# Altium project FMC_HPC_Breakout.PrjPcb
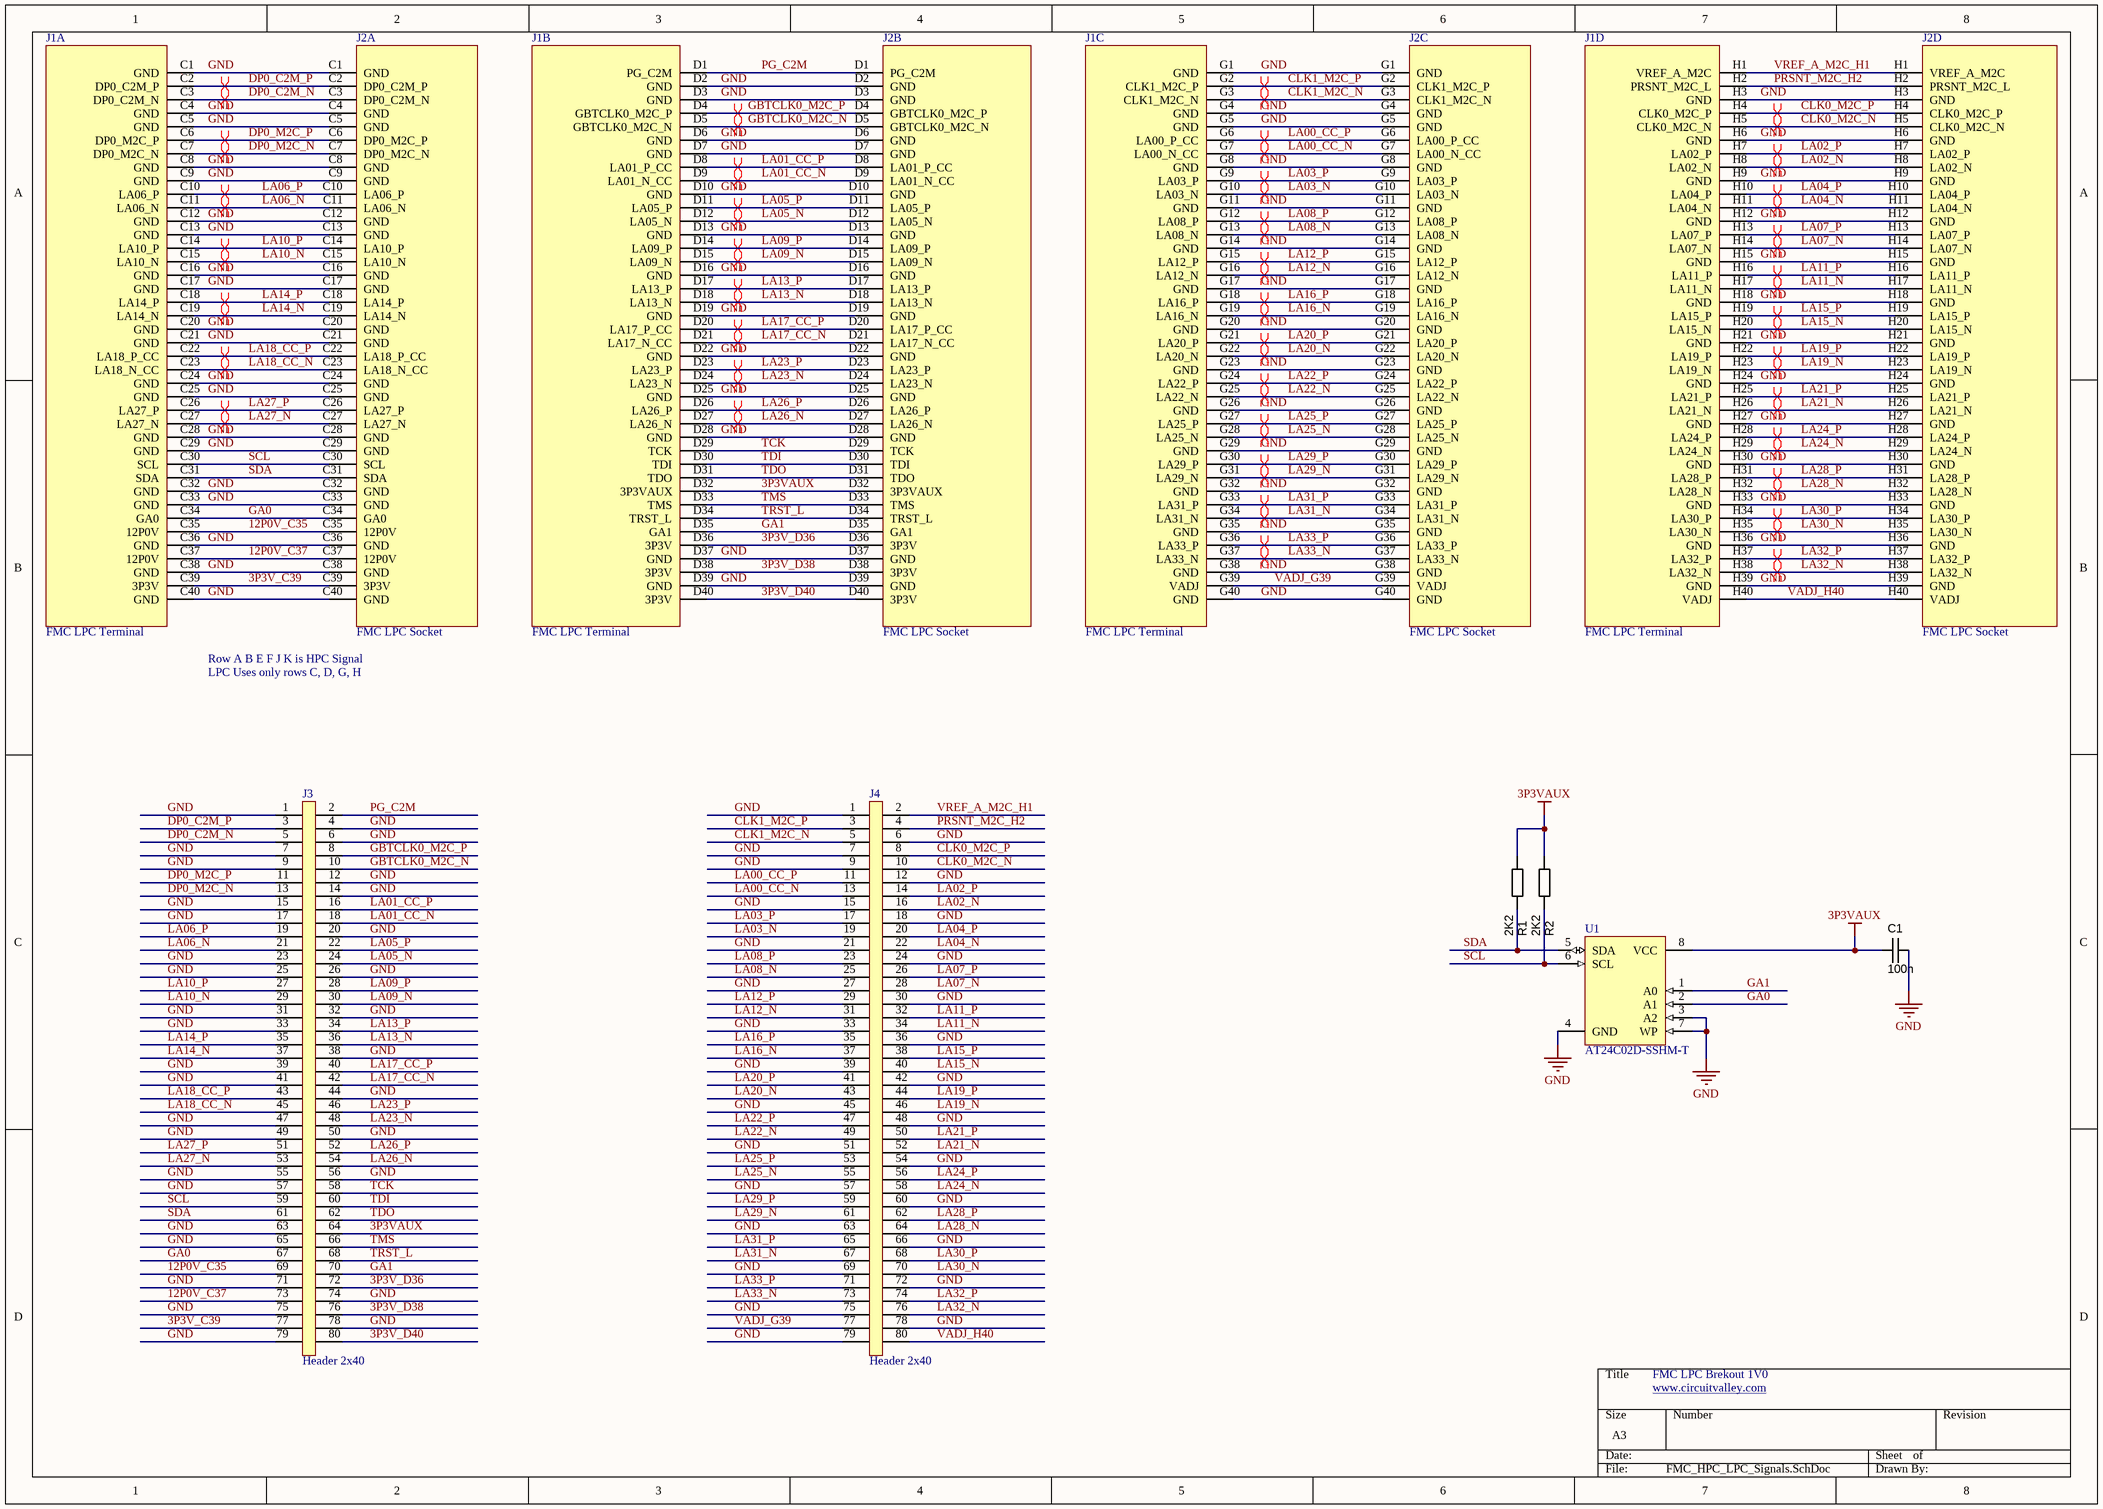
[diagram p0: FMC_HPC_LPC_Signals.SchDoc]
1 sheet, 8 parts. Net scope: global (net labels, ports and power ports of the same name join across sheets).
Board file: FMC_HPC.PcbDoc

## Sheet FMC_HPC_LPC_Signals.SchDoc
size A3; SheetNumber: 1; SheetTotal: 1

### Parts
C1  100n  [CAPC1005N]
J1  FMC LPC Terminal  [SAMTEC_ASP-134604-01]  (parts A,B,C,D of 4)
J2  FMC LPC Socket  [SAMTEC_ASP-134603-01]  (parts A,B,C,D of 4)
J3  Header 2x40  [FTSH-140-01-L-DV]
J4  Header 2x40  [FTSH-140-01-L-DV]
R1  value 2K2  [RESC1005N]  (hidden comment: Thick Film)
R2  value 2K2  [RESC1005N]  (hidden comment: Thick Film)
U1  AT24C02D-SSHM-T  [SOIC8]

### Nets
3P3VAUX: C1.2 J1.D32(3P3VAUX) J2.D32(3P3VAUX) J3.64 R1.1 R2.1 U1.8(VCC)
GND: C1.1 J1.C1(GND) J1.C4(GND) J1.C5(GND) J1.C8(GND) J1.C9(GND) J1.C12(GND) J1.C13(GND) J1.C16(GND) J1.C17(GND) J1.C20(GND) J1.C21(GND) J1.C24(GND) J1.C25(GND) J1.C28(GND) J1.C29(GND) J1.C32(GND) J1.C33(GND) J1.C36(GND) J1.C38(GND) J1.C40(GND) J1.D2(GND) J1.D3(GND) J1.D6(GND) J1.D7(GND) J1.D10(GND) J1.D13(GND) J1.D16(GND) J1.D19(GND) J1.D22(GND) J1.D25(GND) J1.D28(GND) J1.D37(GND) J1.D39(GND) J1.G1(GND) J1.G4(GND) J1.G5(GND) J1.G8(GND) J1.G11(GND) J1.G14(GND) J1.G17(GND) J1.G20(GND) J1.G23(GND) J1.G26(GND) J1.G29(GND) J1.G32(GND) J1.G35(GND) J1.G38(GND) J1.G40(GND) J1.H3(GND) J1.H6(GND) J1.H9(GND) J1.H12(GND) J1.H15(GND) J1.H18(GND) J1.H21(GND) J1.H24(GND) J1.H27(GND) J1.H30(GND) J1.H33(GND) J1.H36(GND) J1.H39(GND) J2.C1(GND) J2.C4(GND) J2.C5(GND) J2.C8(GND) J2.C9(GND) J2.C12(GND) J2.C13(GND) J2.C16(GND) J2.C17(GND) J2.C20(GND) J2.C21(GND) J2.C24(GND) J2.C25(GND) J2.C28(GND) J2.C29(GND) J2.C32(GND) J2.C33(GND) J2.C36(GND) J2.C38(GND) J2.C40(GND) J2.D2(GND) J2.D3(GND) J2.D6(GND) J2.D7(GND) J2.D10(GND) J2.D13(GND) J2.D16(GND) J2.D19(GND) J2.D22(GND) J2.D25(GND) J2.D28(GND) J2.D37(GND) J2.D39(GND) J2.G1(GND) J2.G4(GND) J2.G5(GND) J2.G8(GND) J2.G11(GND) J2.G14(GND) J2.G17(GND) J2.G20(GND) J2.G23(GND) J2.G26(GND) J2.G29(GND) J2.G32(GND) J2.G35(GND) J2.G38(GND) J2.G40(GND) J2.H3(GND) J2.H6(GND) J2.H9(GND) J2.H12(GND) J2.H15(GND) J2.H18(GND) J2.H21(GND) J2.H24(GND) J2.H27(GND) J2.H30(GND) J2.H33(GND) J2.H36(GND) J2.H39(GND) J3.1 J3.4 J3.6 J3.7 J3.9 J3.12 J3.14 J3.15 J3.17 J3.20 J3.23 J3.25 J3.26 J3.31 J3.32 J3.33 J3.38 J3.39 J3.41 J3.44 J3.47 J3.49 J3.50 J3.55 J3.56 J3.57 J3.63 J3.65 J3.71 J3.74 J3.75 J3.78 J3.79 J4.1 J4.6 J4.7 J4.9 J4.12 J4.15 J4.18 J4.21 J4.24 J4.27 J4.30 J4.33 J4.36 J4.39 J4.42 J4.45 J4.48 J4.51 J4.54 J4.57 J4.60 J4.63 J4.66 J4.69 J4.72 J4.75 J4.78 J4.79 U1.3(A2) U1.4(GND) U1.7(WP)
3P3V_C39: J1.C39(3P3V) J2.C39(3P3V) J3.77
3P3V_D36: J1.D36(3P3V) J2.D36(3P3V) J3.72
3P3V_D38: J1.D38(3P3V) J2.D38(3P3V) J3.76
3P3V_D40: J1.D40(3P3V) J2.D40(3P3V) J3.80
12P0V_C35: J1.C35(12P0V) J2.C35(12P0V) J3.69
12P0V_C37: J1.C37(12P0V) J2.C37(12P0V) J3.73
CLK0_M2C_N: J1.H5(CLK0_M2C_N) J2.H5(CLK0_M2C_N) J4.10
CLK0_M2C_P: J1.H4(CLK0_M2C_P) J2.H4(CLK0_M2C_P) J4.8
CLK1_M2C_N: J1.G3(CLK1_M2C_N) J2.G3(CLK1_M2C_N) J4.5
CLK1_M2C_P: J1.G2(CLK1_M2C_P) J2.G2(CLK1_M2C_P) J4.3
DP0_C2M_N: J1.C3(DP0_C2M_N) J2.C3(DP0_C2M_N) J3.5
DP0_C2M_P: J1.C2(DP0_C2M_P) J2.C2(DP0_C2M_P) J3.3
DP0_M2C_N: J1.C7(DP0_M2C_N) J2.C7(DP0_M2C_N) J3.13
DP0_M2C_P: J1.C6(DP0_M2C_P) J2.C6(DP0_M2C_P) J3.11
GA0: J1.C34(GA0) J2.C34(GA0) J3.67 U1.2(A1)
GA1: J1.D35(GA1) J2.D35(GA1) J3.70 U1.1(A0)
GBTCLK0_M2C_N: J1.D5(GBTCLK0_M2C_N) J2.D5(GBTCLK0_M2C_N) J3.10
GBTCLK0_M2C_P: J1.D4(GBTCLK0_M2C_P) J2.D4(GBTCLK0_M2C_P) J3.8
LA00_CC_N: J1.G7(LA00_N_CC) J2.G7(LA00_N_CC) J4.13
LA00_CC_P: J1.G6(LA00_P_CC) J2.G6(LA00_P_CC) J4.11
LA01_CC_N: J1.D9(LA01_N_CC) J2.D9(LA01_N_CC) J3.18
LA01_CC_P: J1.D8(LA01_P_CC) J2.D8(LA01_P_CC) J3.16
LA02_N: J1.H8(LA02_N) J2.H8(LA02_N) J4.16
LA02_P: J1.H7(LA02_P) J2.H7(LA02_P) J4.14
LA03_N: J1.G10(LA03_N) J2.G10(LA03_N) J4.19
LA03_P: J1.G9(LA03_P) J2.G9(LA03_P) J4.17
LA04_N: J1.H11(LA04_N) J2.H11(LA04_N) J4.22
LA04_P: J1.H10(LA04_P) J2.H10(LA04_P) J4.20
LA05_N: J1.D12(LA05_N) J2.D12(LA05_N) J3.24
LA05_P: J1.D11(LA05_P) J2.D11(LA05_P) J3.22
LA06_N: J1.C11(LA06_N) J2.C11(LA06_N) J3.21
LA06_P: J1.C10(LA06_P) J2.C10(LA06_P) J3.19
LA07_N: J1.H14(LA07_N) J2.H14(LA07_N) J4.28
LA07_P: J1.H13(LA07_P) J2.H13(LA07_P) J4.26
LA08_N: J1.G13(LA08_N) J2.G13(LA08_N) J4.25
LA08_P: J1.G12(LA08_P) J2.G12(LA08_P) J4.23
LA09_N: J1.D15(LA09_N) J2.D15(LA09_N) J3.30
LA09_P: J1.D14(LA09_P) J2.D14(LA09_P) J3.28
LA10_N: J1.C15(LA10_N) J2.C15(LA10_N) J3.29
LA10_P: J1.C14(LA10_P) J2.C14(LA10_P) J3.27
LA11_N: J1.H17(LA11_N) J2.H17(LA11_N) J4.34
LA11_P: J1.H16(LA11_P) J2.H16(LA11_P) J4.32
LA12_N: J1.G16(LA12_N) J2.G16(LA12_N) J4.31
LA12_P: J1.G15(LA12_P) J2.G15(LA12_P) J4.29
LA13_N: J1.D18(LA13_N) J2.D18(LA13_N) J3.36
LA13_P: J1.D17(LA13_P) J2.D17(LA13_P) J3.34
LA14_N: J1.C19(LA14_N) J2.C19(LA14_N) J3.37
LA14_P: J1.C18(LA14_P) J2.C18(LA14_P) J3.35
LA15_N: J1.H20(LA15_N) J2.H20(LA15_N) J4.40
LA15_P: J1.H19(LA15_P) J2.H19(LA15_P) J4.38
LA16_N: J1.G19(LA16_N) J2.G19(LA16_N) J4.37
LA16_P: J1.G18(LA16_P) J2.G18(LA16_P) J4.35
LA17_CC_N: J1.D21(LA17_N_CC) J2.D21(LA17_N_CC) J3.42
LA17_CC_P: J1.D20(LA17_P_CC) J2.D20(LA17_P_CC) J3.40
LA18_CC_N: J1.C23(LA18_N_CC) J2.C23(LA18_N_CC) J3.45
LA18_CC_P: J1.C22(LA18_P_CC) J2.C22(LA18_P_CC) J3.43
LA19_N: J1.H23(LA19_N) J2.H23(LA19_N) J4.46
LA19_P: J1.H22(LA19_P) J2.H22(LA19_P) J4.44
LA20_N: J1.G22(LA20_N) J2.G22(LA20_N) J4.43
LA20_P: J1.G21(LA20_P) J2.G21(LA20_P) J4.41
LA21_N: J1.H26(LA21_N) J2.H26(LA21_N) J4.52
LA21_P: J1.H25(LA21_P) J2.H25(LA21_P) J4.50
LA22_N: J1.G25(LA22_N) J2.G25(LA22_N) J4.49
LA22_P: J1.G24(LA22_P) J2.G24(LA22_P) J4.47
LA23_N: J1.D24(LA23_N) J2.D24(LA23_N) J3.48
LA23_P: J1.D23(LA23_P) J2.D23(LA23_P) J3.46
LA24_N: J1.H29(LA24_N) J2.H29(LA24_N) J4.58
LA24_P: J1.H28(LA24_P) J2.H28(LA24_P) J4.56
LA25_N: J1.G28(LA25_N) J2.G28(LA25_N) J4.55
LA25_P: J1.G27(LA25_P) J2.G27(LA25_P) J4.53
LA26_N: J1.D27(LA26_N) J2.D27(LA26_N) J3.54
LA26_P: J1.D26(LA26_P) J2.D26(LA26_P) J3.52
LA27_N: J1.C27(LA27_N) J2.C27(LA27_N) J3.53
LA27_P: J1.C26(LA27_P) J2.C26(LA27_P) J3.51
LA28_N: J1.H32(LA28_N) J2.H32(LA28_N) J4.64
LA28_P: J1.H31(LA28_P) J2.H31(LA28_P) J4.62
LA29_N: J1.G31(LA29_N) J2.G31(LA29_N) J4.61
LA29_P: J1.G30(LA29_P) J2.G30(LA29_P) J4.59
LA30_N: J1.H35(LA30_N) J2.H35(LA30_N) J4.70
LA30_P: J1.H34(LA30_P) J2.H34(LA30_P) J4.68
LA31_N: J1.G34(LA31_N) J2.G34(LA31_N) J4.67
LA31_P: J1.G33(LA31_P) J2.G33(LA31_P) J4.65
LA32_N: J1.H38(LA32_N) J2.H38(LA32_N) J4.76
LA32_P: J1.H37(LA32_P) J2.H37(LA32_P) J4.74
LA33_N: J1.G37(LA33_N) J2.G37(LA33_N) J4.73
LA33_P: J1.G36(LA33_P) J2.G36(LA33_P) J4.71
PG_C2M: J1.D1(PG_C2M) J2.D1(PG_C2M) J3.2
PRSNT_M2C_H2: J1.H2(PRSNT_M2C_L) J2.H2(PRSNT_M2C_L) J4.4
SCL: J1.C30(SCL) J2.C30(SCL) J3.59 R2.2 U1.6(SCL)
SDA: J1.C31(SDA) J2.C31(SDA) J3.61 R1.2 U1.5(SDA)
TCK: J1.D29(TCK) J2.D29(TCK) J3.58
TDI: J1.D30(TDI) J2.D30(TDI) J3.60
TDO: J1.D31(TDO) J2.D31(TDO) J3.62
TMS: J1.D33(TMS) J2.D33(TMS) J3.66
TRST_L: J1.D34(TRST_L) J2.D34(TRST_L) J3.68
VADJ_G39: J1.G39(VADJ) J2.G39(VADJ) J4.77
VADJ_H40: J1.H40(VADJ) J2.H40(VADJ) J4.80
VREF_A_M2C_H1: J1.H1(VREF_A_M2C) J2.H1(VREF_A_M2C) J4.2

### Layout directives
differential pair: CLK0_M2C_N, CLK0_M2C_P, CLK1_M2C_N, CLK1_M2C_P, DP0_C2M_N, DP0_C2M_P, DP0_M2C_N, DP0_M2C_P, GBTCLK0_M2C_N, GBTCLK0_M2C_P, LA00_CC_N, LA00_CC_P, LA01_CC_N, LA01_CC_P, LA02_N, LA02_P, LA03_N, LA03_P, LA04_N, LA04_P, LA05_N, LA05_P, LA06_N, LA06_P, LA07_N, LA07_P, LA08_N, LA08_P, LA09_N, LA09_P, LA10_N, LA10_P, LA11_N, LA11_P, LA12_N, LA12_P, LA13_N, LA13_P, LA14_N, LA14_P, LA15_N, LA15_P, LA16_N, LA16_P, LA17_CC_N, LA17_CC_P, LA18_CC_N, LA18_CC_P, LA19_N, LA19_P, LA20_N, LA20_P, LA21_N, LA21_P, LA22_N, LA22_P, LA23_N, LA23_P, LA24_N, LA24_P, LA25_N, LA25_P, LA26_N, LA26_P, LA27_N, LA27_P, LA28_N, LA28_P, LA29_N, LA29_P, LA30_N, LA30_P, LA31_N, LA31_P, LA32_N, LA32_P, LA33_N, LA33_P

### Notes on the sheet
- Row A B E F J K is HPC Signal
- LPC Uses only rows C, D, G, H
- FMC LPC Brekout 1V0
- www.circuitvalley.com <http://www.circuitvalley.com>

### Library data of the parts
C1 = CAPC_10n_0402_16V_10%: Capacitor SMD Cer 10nF 10% 16V X7R 0402; Manufacturer 1: AVX Corporation; Manufacturer Part Number 1: 0402YC103KAT2A; Ratings: 16V; X7R; Tolerance: ±10%; Operating Temperature: -55°C ~ 125°C; Package / Case: 0402 (1005 Metric); Size / Dimension: 0.039" L x 0.020" W (1.00mm x 0.50mm); Manufacturer 2: Yageo; Manufacturer Part Number 2: CC0402KRX7R7BB103; Supplier 1: Digi-Key; Supplier Part Number 1: 478-1114-1-ND; ComponentLink1URL: http://www.avx.com/docs/Catalogs/cx7r.pdf; ComponentLink1Description: http://www.avx.com/docs/Catalogs/cx7r.pdf; Supplier 2: Digi-Key; Supplier Part Number 2: 311-1042-1-ND; ComponentLink2URL: http://www.yageo.com/documents/recent/UPY-GPHC_X7R_6.3V-to-50V_8.pdf; ComponentLink2Description: http://www.yageo.com/documents/recent/UPY-GPHC_X7R_6.3V-to-50V_8.pdf; Value: 100n
J1 = FMC_LPC_TERMINAL: FMC LPC Connector Terminal ASP-134604-01
J2 = FMC_LPC_SOCKET: FMC LPC Connector Socket  ASP-134603-01
J3 J4 = Header_2x40
R1 R2 = RES_3K3_0402_5%: Resistor SMD chip 3.3k Ohm 0.063W 5% 0402; Manufacturer 1: Yageo; Manufacturer Part Number 1: RC0402JR-073K3L; Ratings: 1/16 W; Package / Case: 0402 (1005 metric); Tolerance: ±5%; Material: Thick Film; Supplier 1: Digi-Key; Supplier Part Number 1: 311-3.3KJRCT-ND; ComponentLink1URL: http://www.yageo.com/documents/recent/PYu-RC0402_51_RoHS_L_6.pdf; ComponentLink1Description: http://www.yageo.com/documents/recent/PYu-RC0402_51_RoHS_L_6.pdf
U1 = AT24C02D-SSHM-T: 2Kbit I2C EEPROM